# Altium schematic sheet REGULATOR.SchDoc
size A3
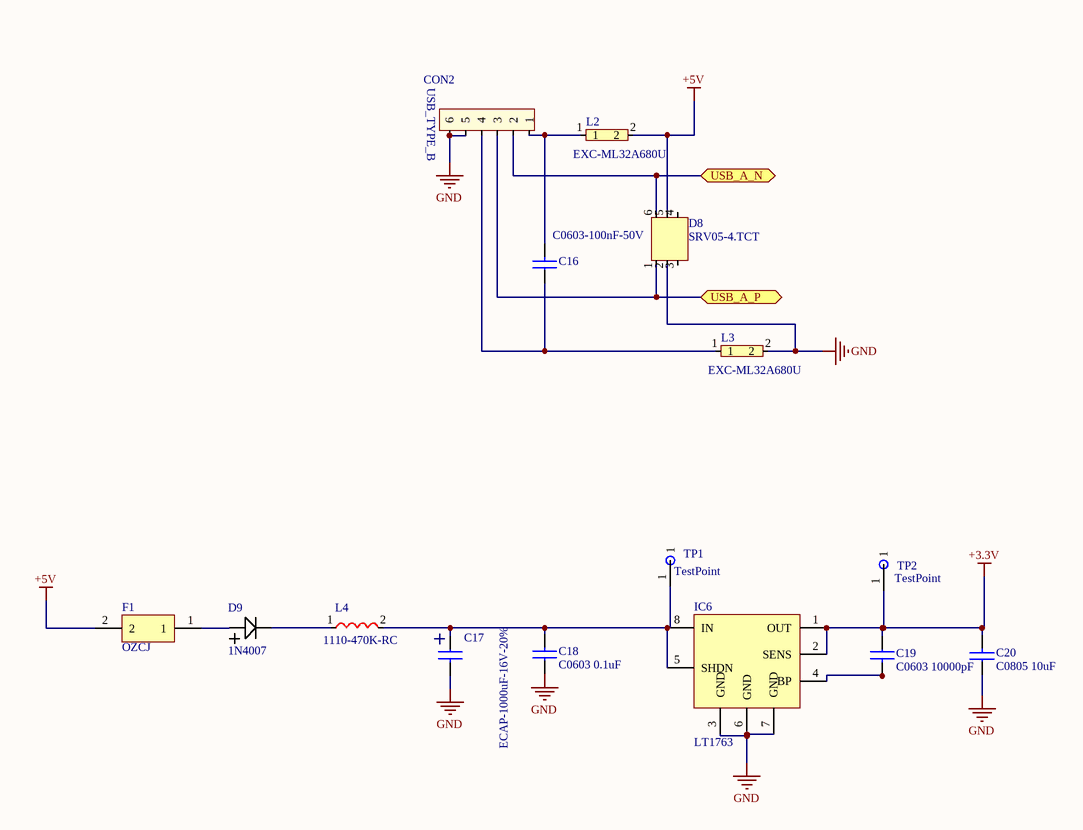
[diagram p0: REGULATOR.SchDoc]

## Parts
C16  C0603-100nF-50V  [C0603]
C17  ECAP-1000uF-16V-20%  [CAP_SMT]
C18  C0603 0.1uF  [C0603]
C19  C0603 10000pF  [C0603]
C20  C0805 10uF  [C0805]
CON2  (no value)  [CON_670688000]
D8  SRV05-4.TCT  [SOT23]
D9  1N4007  [1N4007]
F1  OZCJ  [OZCJ]
IC6  LT1763  [SOIC127P600X170-8N]
L2  EXC-ML32A680U  [L1608]
L3  EXC-ML32A680U  [L1608]
L4  1110-470K-RC  [1110 Coil]
TP1  TestPoint  [TestPoint]
TP2  TestPoint  [TestPoint]

## Ports
USB_A_N, USB_A_P

## Nets
+3.3V: C19.1 C20.2 IC6.1(OUT) IC6.2(SENS) TP2.1
+5V: D8.5 F1.2 L2.2
GND: C17.2 C18.1 C20.1 CON2.5 CON2.6 D8.2 IC6.3(GND) IC6.6(GND) IC6.7(GND) L3.2
USB_A_N: CON2.2 D8.6 ; port USB_A_N
USB_A_P: CON2.3 D8.1 ; port USB_A_P
NetC16_1: C16.1 CON2.4 L3.1
NetC16_2: C16.2 CON2.1 L2.1
NetC17_1: C17.1 C18.2 IC6.5(SHDN) IC6.8(IN) L4.2 TP1.1
NetC19_2: C19.2 IC6.4(BP)
NetD9_1: D9.1 F1.1
NetD9_2: D9.2 L4.1

Not connected (* = marked no-connect by the designer): D8 3 4

## Notes on the sheet
- (in symbol 670688000) USB_TYPE_B

## Library data of the parts
C16 = C0603-100nF-50V: CL10B104KB8NNNC
C17 = ECAP-1000uF-16V-20%: CAP ALUM 1000pF 20% 16V / UCL1C102MNL1GS
C18 = C0603 0.1uF: CAP CER 0.1uF 16V X7R 0603 / CL10B104K08NNNC
C19 = C0603 10000pF: CAP CER 10000pF 25V 10% X7R 0603 / CL10B103KA8NNNC
C20 = C0805 10uF: CAP CER 10uF 6.3V X7R 0805 / C0805C106K9RACTU
CON2 = 670688000: CONN USB RT ANG RECPT TYPE B BLK
D8 = SRV05-4.TCT: TVS DIODE 5V 17.5V DIODE SOT23-6
D9 = 1N4007: ONSEMI 1N4007
L2 L3 = EXC-ML32A680U: FERRITE BEAD 68 OHM 1206
L4 = 1110-470K-RC: FIXED IND 47UH 2.8A 62MOHM TH